# Altium schematic sheet USB.SchDoc
size A4
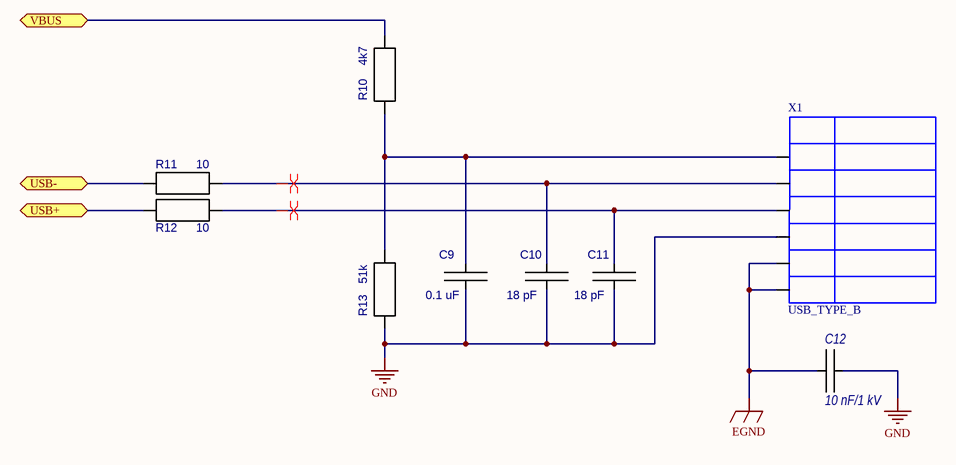
[diagram p0: USB.SchDoc]

## Parts
C9  0.1 uF  [CAP_0805]
C10  18 pF  [CAP_0805]
C11  18 pF  [CAP_0805]
C12  10 nF/1 kV
R10  4k7  [RES_0805]
R11  10  [RES_0805]
R12  10  [RES_0805]
R13  51k  [RES_0805]
X1  USB_TYPE_B  [USB_TypeB_Tyco]

## Ports
USB+ (bidir), USB- (bidir), VBUS (bidir)

## Nets
EGND: C12.1 X1.5 X1.6
GND: C9.2 C10.2 C11.2 C12.2 R13.2 X1.4
USB+: R12.2 ; port USB+
USB-: R11.2 ; port USB-
VBUS: R10.1 ; port VBUS
NetC9_1: C9.1 R10.2 R13.1 X1.1
NetC10_1: C10.1 R11.1 X1.2
NetC11_1: C11.1 R12.1 X1.3

## Layout directives
differential pair: NetC10_1, NetC11_1

## Library data of the parts
C9-C11 = CAP_0805: Value: *
C12 = Cap
R10-R13 = RES_0805: Value: *